# Altium schematic sheet main.SchDoc
size A; SheetNumber: 1; SheetTotal: 1
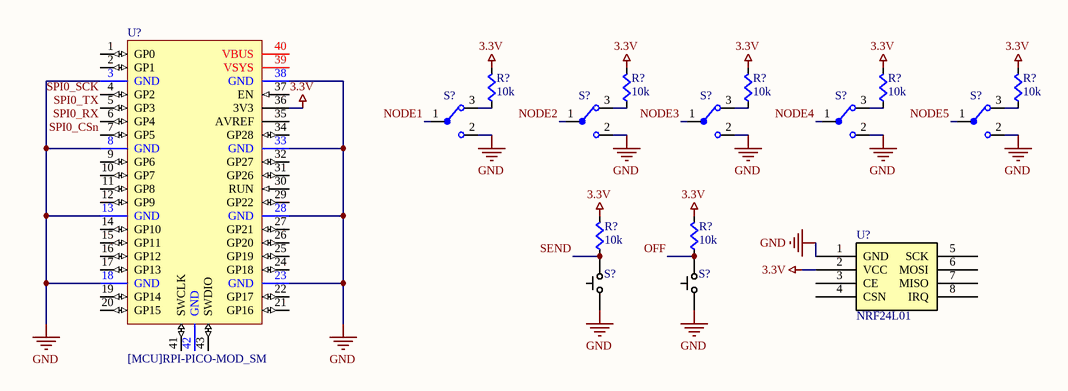
[diagram p0: main.SchDoc]

## Parts
(Parts that share a designator on the sheet are numbered #1, #2 ... from top to bottom, then left to right.)
R?#1  value 10k  [RES0603]  (hidden comment: Res)
R?#2  value 10k  [RES0603]  (hidden comment: Res)
R?#3  value 10k  [RES0603]  (hidden comment: Res)
R?#4  value 10k  [RES0603]  (hidden comment: Res)
R?#5  value 10k  [RES0603]  (hidden comment: Res)
R?#6  value 10k  [RES0603]  (hidden comment: Res)
R?#7  value 10k  [RES0603]  (hidden comment: Res)
S?#1  [Switch] 450301014042  [[SWITCH]450301014042]  (value not drawn)
S?#2  [Switch] 450301014042  [[SWITCH]450301014042]  (value not drawn)
S?#3  [Switch] 450301014042  [[SWITCH]450301014042]  (value not drawn)
S?#4  [Switch] 450301014042  [[SWITCH]450301014042]  (value not drawn)
S?#5  [Switch] 450301014042  [[SWITCH]450301014042]  (value not drawn)
S?#6  [SPST] SMD Pushbutton  [[SPST] SMD Pushbutton]  (value not drawn)
S?#7  [SPST] SMD Pushbutton  [[SPST] SMD Pushbutton]  (value not drawn)
U?#1  [MCU]RPI-PICO-MOD_SM  [RPI-PICO-MOD]
U?#2  NRF24L01  [NRF+LA+PNA+BREAKOUT]

## Nets
3.3V: R?#1.1(A) R?#2.1(A) R?#3.1(A) R?#4.1(A) R?#5.1(A) R?#6.1(A) R?#7.1(A) U?#1.36(3V3) U?#2.2(VCC)
GND: S?#1.2 S?#2.2 S?#3.2 S?#4.2 S?#5.2 S?#6.1 S?#7.1 U?#1.3(GND) U?#1.8(GND) U?#1.13(GND) U?#1.18(GND) U?#1.23(GND) U?#1.28(GND) U?#1.33(GND) U?#1.38(GND) U?#2.1(GND)
NODE1: S?#1.1
NODE2: S?#2.1
NODE3: S?#3.1
NODE4: S?#4.1
NODE5: S?#5.1
OFF: R?#7.2(B) S?#7.2
SEND: R?#6.2(B) S?#6.2
SPI0_CSn: U?#1.7(GP5)
SPI0_RX: U?#1.6(GP4)
SPI0_SCK: U?#1.4(GP2)
SPI0_TX: U?#1.5(GP3)
NetR?#1_2: R?#1.2(B) S?#1.3
NetR?#2_2: R?#2.2(B) S?#2.3
NetR?#3_2: R?#3.2(B) S?#3.3
NetR?#4_2: R?#4.2(B) S?#4.3
NetR?#5_2: R?#5.2(B) S?#5.3

Not connected (* = marked no-connect by the designer): U?#1 1(GP0) 2(GP1) 9(GP6) 10(GP7) 11(GP8) 12(GP9) 14(GP10) 15(GP11) 16(GP12) 17(GP13) 19(GP14) 20(GP15) 21(GP16) 22(GP17) 24(GP18) 25(GP19) 26(GP20) 27(GP21) 29(GP22) 30(RUN) 31(GP26) 32(GP27) 34(GP28) 35(AVREF) 37(EN) 39(VSYS) 40(VBUS) 41(SWCLK) 42(GND) 43(SWDIO); U?#2 3(CE) 4(CSN) 5(SCK) 6(MOSI) 7(MISO) 8(IRQ)

## Library data of the parts
R?#1-R?#7 = Res: SMD, RES0603; Supplier 1: Digi-Key; Supplier Part Number 1: RMCF0603JT10K0CT-ND
S?#1-S?#5 = [Switch] 450301014042: SWITCH SLIDE SPDT 500MA 12V; MF: {'manufacturer': u'W\xfcrth Elektronik'}; Package: None; Price: None; Value: *; MP: 450301014042; Availability: Unavailable
S?#6 S?#7 = [SPST] SMD Pushbutton: PTS815SJM250SMTRLFS; Supplier 1: DigiKey; Supplier Part Number 1: CKN12215-6-ND
U?#1 = [MCU]RPI-PICO-MOD_SM: RASPBERRY PI PICO RP2040 BOARD NO TEST PADS; Manufacturer: Raspberry Pi Foundation; Manufacturer Part No: SC0915; Mounting Technology: SMT; Supplier: DigiKey; Supplier Part No: 2648-SC0915CT-ND; Supplier Link: https://www.digikey.com/en/products/detail/raspberry-pi/SC0915/13684020
U?#2 = NRF24L01+LA+PNA-Breakout: This module based on Nordic nRF24L01+ with integrated Power Amplifier (PA) and Low-Noise-Amplifier / (LNA) for extended range of up to 1km. This transceiver IC operates in the 2.4GHz